# Altium schematic sheet RV8301.SchDoc
size A4
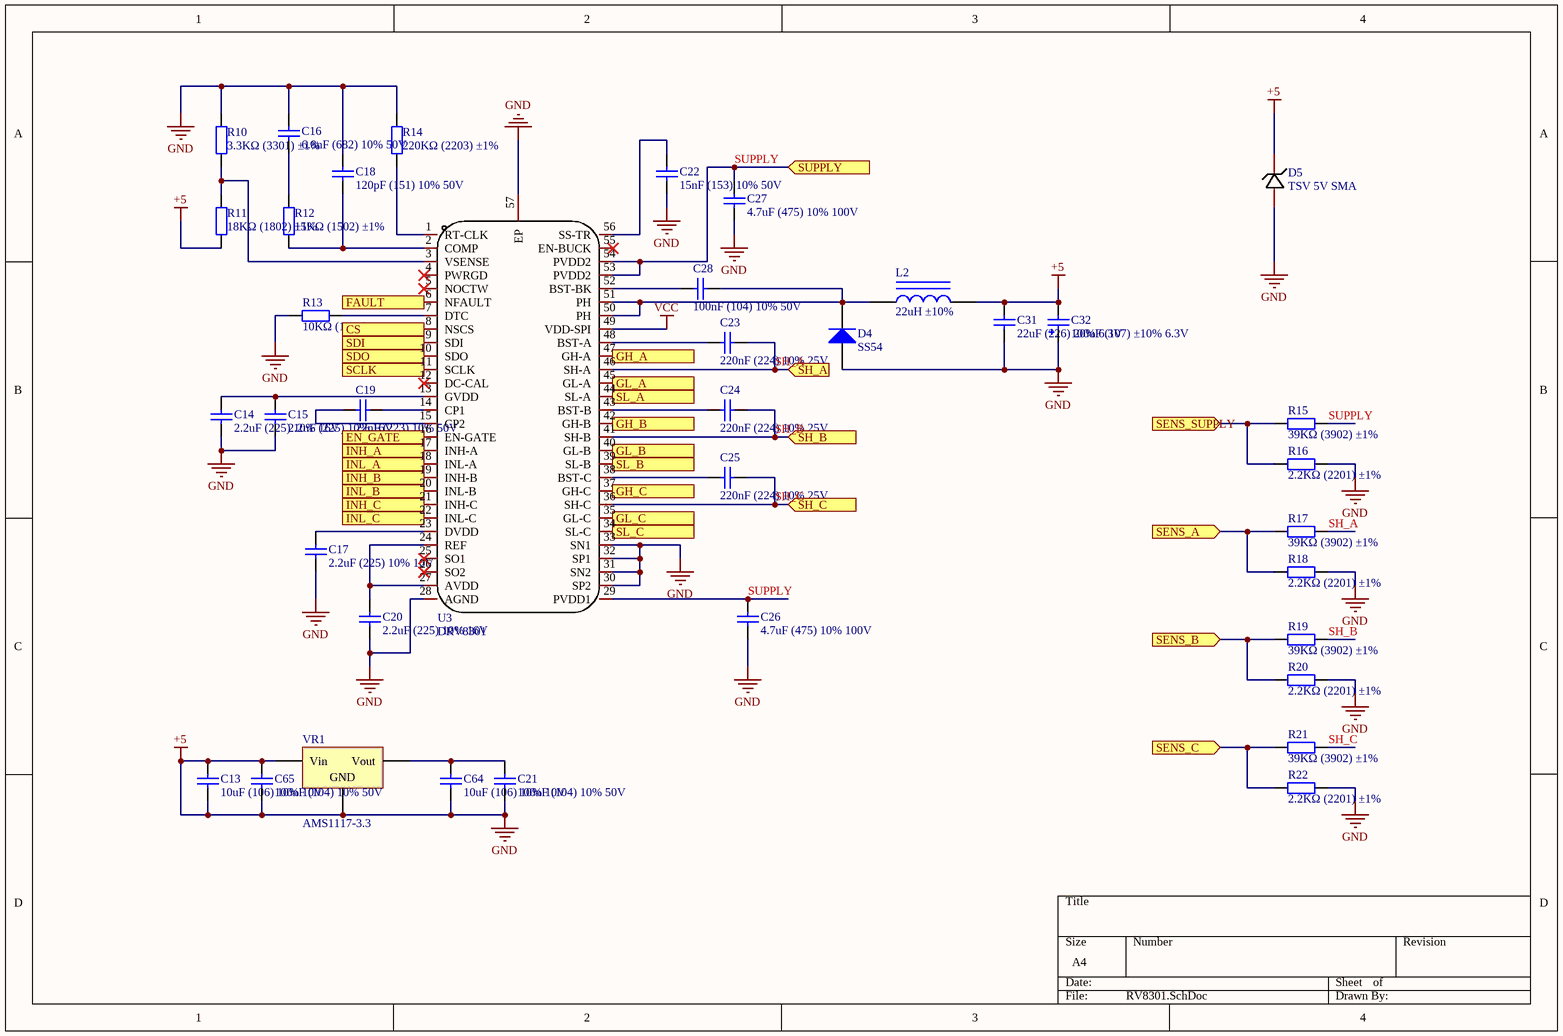
[diagram p0: RV8301.SchDoc]

## Parts
C13  10uF (106) 10% 10V  [0603_C]
C14  2.2uF (225) 10% 16V  [0603_C]
C15  2.2uF (225) 10% 16V  [0603_C]
C16  6.8nF (682) 10% 50V  [0603_C]
C17  2.2uF (225) 10% 16V  [0603_C]
C18  120pF (151) 10% 50V  [0603_C]
C19  22nF (223) 10% 50V  [0603_C]
C20  2.2uF (225) 10% 16V  [0603_C]
C21  100nF (104) 10% 50V  [0603_C]
C22  15nF (153) 10% 50V  [0603_C]
C23  220nF (224) 10% 25V  [0603_C]
C24  220nF (224) 10% 25V  [0603_C]
C25  220nF (224) 10% 25V  [0603_C]
C26  4.7uF (475) 10% 100V  [1210_C]
C27  4.7uF (475) 10% 100V  [1210_C]
C28  100nF (104) 10% 50V  [0603_C]
C31  22uF (226) 20% 6.3V  [0603_C]
C32  100uF (107) ±10% 6.3V  [CASE-B_3528]
C64  10uF (106) 10% 10V  [0603_C]
C65  100nF (104) 10% 50V  [0603_C]
D4  SS54  [SMA(DO-214AC)_S1]
D5  TSV 5V SMA  [TSV 5V SMA]
L2  22uH ±10%  [22uh3A]
R10  3.3KΩ (3301) ±1%  [0603_R]
R11  18KΩ (1802) ±1%  [0603_R]
R12  15KΩ (1502) ±1%  [0603_R]
R13  10KΩ (1002) ±1%  [0603_R]
R14  220KΩ (2203) ±1%  [0603_R]
R15  39KΩ (3902) ±1%  [0603_R]
R16  2.2KΩ (2201) ±1%  [0603_R]
R17  39KΩ (3902) ±1%  [0603_R]
R18  2.2KΩ (2201) ±1%  [0603_R]
R19  39KΩ (3902) ±1%  [0603_R]
R20  2.2KΩ (2201) ±1%  [0603_R]
R21  39KΩ (3902) ±1%  [0603_R]
R22  2.2KΩ (2201) ±1%  [0603_R]
U3  DRV8301  [DRV8301]
VR1  AMS1117-3.3  [SOT-223]

## Ports
CS (in), EN_GATE (in), FAULT (in), GH_A (in), GH_B (in), GH_C (in), GL_A (in), GL_B (in), GL_C (in), INH_A (in), INH_B (in), INH_C (in), INL_A (in), INL_B (in), INL_C (in), SCLK (in), SDI (in), SDO (in), SENS_A (in), SENS_B (in), SENS_C (in), SENS_SUPPLY (in), SH_A (in), SH_B (in), SH_C (in), SL_A (in), SL_B (in), SL_C (in), SUPPLY (in)

## Nets
+5: C13.1 C13.2 C14.1 C15.1 C16.2 C17.1 C18.2 C20.1 C21.1 C22.1 C26.1 C27.1 C31.1 C31.2 C32.1 C32.2 C64.1 C65.1 C65.2 D4.1(A) D5.1(C) D5.2(A) L2.2 R10.2 R11.1 R13.1 R14.2 R16.2 R18.2 R20.2 R22.2 U3.28(AGND) U3.30(SP2) U3.31(SN2) U3.32(SP1) U3.33(SN1) U3.57(EP) VR1.1(GND) VR1.3(Vin)  [also labelled GND]
VCC: U3.49(VDD-SPI)
CS: U3.8(NSCS) ; port CS
EN_GATE: U3.16(EN-GATE) ; port EN_GATE
FAULT: U3.6(NFAULT) ; port FAULT
GH_A: U3.47(GH-A) ; port GH_A
GH_B: U3.42(GH-B) ; port GH_B
GH_C: U3.37(GH-C) ; port GH_C
GL_A: U3.45(GL-A) ; port GL_A
GL_B: U3.40(GL-B) ; port GL_B
GL_C: U3.35(GL-C) ; port GL_C
INH_A: U3.17(INH-A) ; port INH_A
INH_B: U3.19(INH-B) ; port INH_B
INH_C: U3.21(INH-C) ; port INH_C
INL_A: U3.18(INL-A) ; port INL_A
INL_B: U3.20(INL-B) ; port INL_B
INL_C: U3.22(INL-C) ; port INL_C
SCLK: U3.11(SCLK) ; port SCLK
SDI: U3.9(SDI) ; port SDI
SDO: U3.10(SDO) ; port SDO
SENS_A: R17.1 R18.1 ; port SENS_A
SENS_B: R19.1 R20.1 ; port SENS_B
SENS_C: R21.1 R22.1 ; port SENS_C
SENS_SUPPLY: R15.1 R16.1 ; port SENS_SUPPLY
SH_A: C23.2 R17.2 U3.46(SH-A) ; port SH_A
SH_B: C24.2 R19.2 U3.41(SH-B) ; port SH_B
SH_C: C25.2 R21.2 U3.36(SH-C) ; port SH_C
SL_A: U3.44(SL-A) ; port SL_A
SL_B: U3.39(SL-B) ; port SL_B
SL_C: U3.34(SL-C) ; port SL_C
SUPPLY: C26.2 C27.2 R15.2 U3.29(PVDD1) U3.53(PVDD2) U3.54(PVDD2) ; port SUPPLY
NetC14_2: C14.2 C15.2 U3.13(GVDD)
NetC16_1: C16.1 R12.2
NetC17_2: C17.2 U3.23(DVDD)
NetC18_1: C18.1 R12.1 U3.2(COMP)
NetC19_1: C19.1 U3.15(CP2)
NetC19_2: C19.2 U3.14(CP1)
NetC20_2: C20.2 U3.24(REF) U3.27(AVDD)
NetC21_2: C21.2 C64.2 VR1.2(Vout)
NetC22_2: C22.2 U3.56(SS-TR)
NetC23_1: C23.1 U3.48(BST-A)
NetC24_1: C24.1 U3.43(BST-B)
NetC25_1: C25.1 U3.38(BST-C)
NetC28_1: C28.1 U3.52(BST-BK)
NetC28_2: C28.2 D4.2(K) L2.1 U3.50(PH) U3.51(PH)
NetR10_1: R10.1 R11.2 U3.3(VSENSE)
NetR13_2: R13.2 U3.7(DTC)
NetR14_1: R14.1 U3.1(RT-CLK)

Not connected (* = marked no-connect by the designer): U3 4(PWRGD)* 5(NOCTW)* 12(DC-CAL)* 25(SO1)* 26(SO2)* 55(EN-BUCK)*

## Library data of the parts
C13 C64 = 0603 10uF (106) 10% 10V: 贴片电容; ComponentLink1Description: 供应商链接; ComponentLink1URL: http://www.szlcsc.com/product/details_20411.html; Package: 0603; Supplier: LC; SuppliersPartNumber: C19702
C14 C15 C17 C20 = 0603 2.2uF (225) 10% 16V: 贴片电容; ComponentLink1Description: 供应商链接; ComponentLink1URL: http://www.szlcsc.com/product/details_24366.html; Package: 0603; Supplier: LC; SuppliersPartNumber: C23630
C16 = 0603 6.8nF (682) 10% 50V: 贴片电容; ComponentLink1Description: 供应商链接; ComponentLink1URL: http://www.szlcsc.com/product/details_1983.html; Package: 0603; Supplier: LC; SuppliersPartNumber: C1631
C18 = 0603 150pF (151) 10% 50V: 贴片电容; ComponentLink1Description: 供应商链接; ComponentLink1URL: http://www.szlcsc.com/product/details_1946.html; Package: 0603; Supplier: LC; SuppliersPartNumber: C1594
C19 = 0603 22nF (223) 10% 50V: 贴片电容; ComponentLink1Description: 供应商链接; ComponentLink1URL: http://www.szlcsc.com/product/details_21834.html; Package: 0603; Supplier: LC; SuppliersPartNumber: C21122
C21 C28 C65 = 0603 100nF (104) 10% 50V: 贴片电容; ComponentLink1Description: 供应商链接; ComponentLink1URL: http://www.szlcsc.com/product/details_15331.html; Package: 0603; Supplier: LC; SuppliersPartNumber: C14663
C22 = 0603 15nF (153) 10% 50V: 贴片电容; ComponentLink1Description: 供应商链接; ComponentLink1URL: http://www.szlcsc.com/product/details_1948.html; Package: 0603; Supplier: LC; SuppliersPartNumber: C1596
C23-C25 = 0603 220nF (224) 10% 25V: 贴片电容; ComponentLink1Description: 供应商链接; ComponentLink1URL: http://www.szlcsc.com/product/details_21832.html; Package: 0603; Supplier: LC; SuppliersPartNumber: C21120
C26 C27 = 0603 4.7uF (475) 10% 16V: 贴片电容; ComponentLink1Description: 供应商链接; ComponentLink1URL: http://www.szlcsc.com/product/details_20375.html; Package: 0603; Supplier: LC; SuppliersPartNumber: C19666
C31 = 0603 22uF (226) 20% 6.3V: 贴片电容; ComponentLink1Description: 供应商链接; ComponentLink1URL: http://www.szlcsc.com/product/details_60514.html; Package: 0603; Supplier: LC; SuppliersPartNumber: C59461
C32 = 3528 100uF (107) 10% 6.3V: 钽电容; ComponentLink1Description: 供应商链接; ComponentLink1URL: http://www.szlcsc.com/product/details_16815.html; Package: 3528; Supplier: LC; SuppliersPartNumber: C16133
D4 = SMA(DO-214AC) SS54: 二极管; ComponentLink1Description: 供应商链接; ComponentLink1URL: http://www.szlcsc.com/product/details_23178.html; Package: SMA(DO-214AC); Supplier: LC; SuppliersPartNumber: C22452
L2 = 0805 22uH 10%: 贴片电感; ComponentLink1Description: 供应商链接; ComponentLink1URL: http://www.szlcsc.com/product/details_33340.html; Package: 0805; Supplier: LC; SuppliersPartNumber: C32375
R10 = 0603 3.3KΩ (3301) 1%: 贴片电阻; ComponentLink1Description: 供应商链接; ComponentLink1URL: http://www.szlcsc.com/product/details_23705.html; Package: 0603; Supplier: LC; SuppliersPartNumber: C22978
R11 = 0603 18KΩ (1802) 1%: 贴片电阻; ComponentLink1Description: 供应商链接; ComponentLink1URL: http://www.szlcsc.com/product/details_26553.html; Package: 0603; Supplier: LC; SuppliersPartNumber: C25810
R12 = 0603 15KΩ (1502) 1%: 贴片电阻; ComponentLink1Description: 供应商链接; ComponentLink1URL: http://www.szlcsc.com/product/details_23536.html; Package: 0603; Supplier: LC; SuppliersPartNumber: C22809
R13 = 0603 10KΩ (1002) 1%: 贴片电阻; ComponentLink1Description: 供应商链接; ComponentLink1URL: http://www.szlcsc.com/product/details_26547.html; Package: 0603; Supplier: LC; SuppliersPartNumber: C25804
R14 = 0603 220KΩ (2203) 1%: 贴片电阻; ComponentLink1Description: 供应商链接; ComponentLink1URL: http://www.szlcsc.com/product/details_23688.html; Package: 0603; Supplier: LC; SuppliersPartNumber: C22961
R15 R17 R19 R21 = 0603 39KΩ (3902) 1%: 贴片电阻; ComponentLink1Description: 供应商链接; ComponentLink1URL: http://www.szlcsc.com/product/details_23880.html; Package: 0603; Supplier: LC; SuppliersPartNumber: C23153
R16 R18 R20 R22 = 0603 2.2KΩ (2201) 1%: 贴片电阻; ComponentLink1Description: 供应商链接; ComponentLink1URL: http://www.szlcsc.com/product/details_4597.html; Package: 0603; Supplier: LC; SuppliersPartNumber: C4190
VR1 = SOT-223 AMS1117-3.3: 低压差线性稳压(LDO); ComponentLink1Description: 供应商链接; ComponentLink1URL: http://www.szlcsc.com/product/details_6652.html; Package: SOT-223; Supplier: LC; SuppliersPartNumber: C6186